# Altium project DC SUPPLY.PrjPcb
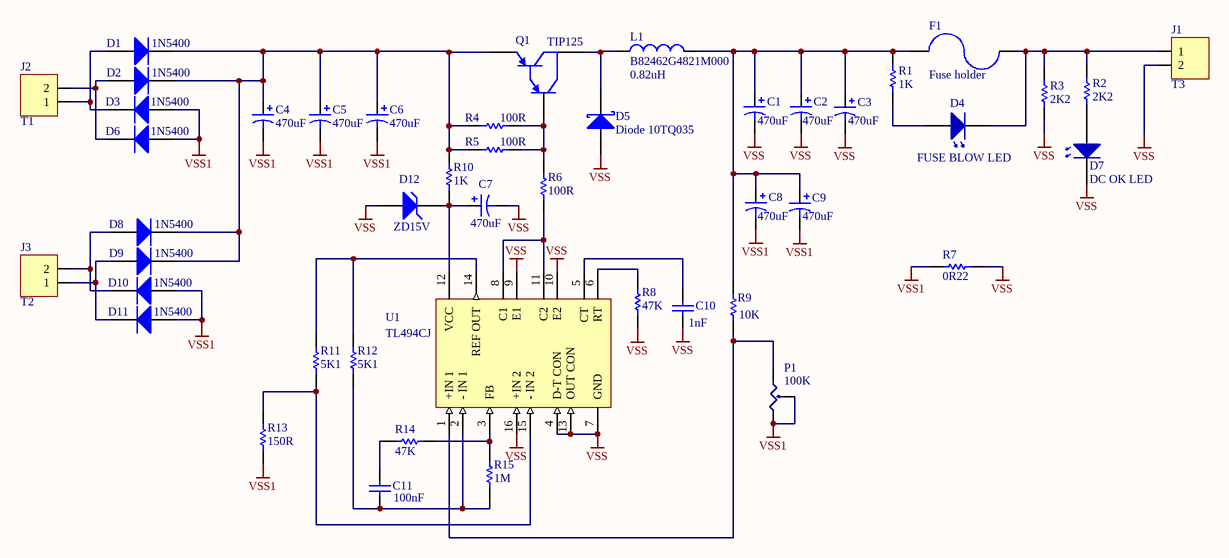
[diagram p0: DC SUPPLY.SchDoc]
1 sheet, 46 parts. Net scope: global (net labels, ports and power ports of the same name join across sheets).
Board file: DC SUPPLY.PcbDoc

## Sheet DC SUPPLY.SchDoc: DC Power Supply
size A4; Author: eldar6776@hotmail.com; DrawnBy: Eldar Dedić; Organization: PROVEN d.o.o.; Address1: Adema Buće 102; Address2: 71000 Sarajevo; Address3: Federacija BiH; Address4: Bosna i Hercegovina; DocumentNumber: DC-120614; Revision: 001; SheetNumber: 1; SheetTotal: 1; ProjectName: TRANSPORT MATERIJALA LINIJE 5

### Parts
C1  470uF  [CAPPR5-10X16]
C2  470uF  [CAPPR5-10X16]
C3  470uF  [CAPPR5-10X16]
C4  470uF  [CAPPR5-10X16]
C5  470uF  [CAPPR5-10X16]
C6  470uF  [CAPPR5-10X16]
C7  470uF  [CAPPR5-10X16]
C8  470uF  [CAPPR5-10X16]
C9  470uF  [CAPPR5-10X16]
C10  value 1nF  [0805]
C11  value 100nF  [0805]
D1  1N5400  [DO-201AD]
D2  1N5400  [DO-201AD]
D3  1N5400  [DO-201AD]
D4  FUSE BLOW LED  [LED 3 mm]
D5  Diode 10TQ035  [TO-220AC]
D6  1N5400  [DO-201AD]
D7  DC OK LED  [LED 3 mm]
D8  1N5400  [DO-201AD]
D9  1N5400  [DO-201AD]
D10  1N5400  [DO-201AD]
D11  1N5400  [DO-201AD]
D12  ZD15V  [299-02]
F1  Fuse holder  [FUSE HOLDER]
J1  T3  [TERMINAL_BLOCK_2]
J2  T1  [TERMINAL_BLOCK_2]
J3  T2  [TERMINAL_BLOCK_2]
L1  B82462G4821M000  value 0.82uH  [CAPPR5-10X16]
P1  100K  [POT]
Q1  TIP125  [221A-02]
R1  1K  [ERA-0805]
R2  2K2  [ERA-0805]
R3  2K2  [ERA-0805]
R4  100R  [RD3.2x1.7]
R5  100R  [RD3.2x1.7]
R6  100R  [RD3.2x1.7]
R7  0R22  [R9x2.8]
R8  47K  [ERA-0805]
R9  10K  [ERA-0805]
R10  1K  [RD6.35x2.3]
R11  5K1  [ERA-0805]
R12  5K1  [ERA-0805]
R13  150R  [ERA-0805]
R14  47K  [ERA-0805]
R15  1M  [ERA-0805]
U1  TL494CJ  [J016]

### Nets
VSS: C1.2 C2.2 C3.2 C7.2 C10.1 D5.3(A) D7.1 D12.1(A) J1.2 R3.1 R7.2 R8.1 U1.4(D-T_CON) U1.7(GND) U1.9(E1) U1.10(E2) U1.13(OUT_CON) U1.16(+IN_2)
VSS1: C4.2 C5.2 C6.2 C8.2 C9.2 D3.1(A) D6.1(A) D10.1(A) D11.1(A) P1.2 P1.3 R7.1 R13.1
NetC1_1: C1.1 C2.1 C3.1 C8.1 C9.1 F1.1 L1.2 R1.2 R9.2
NetC4_1: C4.1 C5.1 C6.1 D1.2(K) D2.2(K) D8.2(K) D9.2(K) Q1.3(E) R4.1 R5.1 R10.2
NetC7_1: C7.1 D12.2(K) R10.1 U1.12(VCC)
NetC10_2: C10.2 U1.5(CT)
NetC11_1: C11.1 R14.1
NetC11_2: C11.2 R12.1 R15.1 U1.2(-_IN_1)
NetD1_1: D1.1(A) D3.2(K) J2.1
NetD2_1: D2.1(A) D6.2(K) J2.2
NetD4_1: D4.1 F1.2 J1.1 R2.2 R3.2
NetD4_2: D4.2 R1.1
NetD5_1: D5.1(K) L1.1 Q1.2(C)
NetD7_2: D7.2 R2.1
NetD8_1: D8.1(A) D10.2(K) J3.2
NetD9_1: D9.1(A) D11.2(K) J3.1
NetP1_1: P1.1 R9.1 U1.1(+IN_1)
NetQ1_1: Q1.1(B) R4.2 R5.2 R6.2
NetR6_1: R6.1 U1.8(C1) U1.11(C2)
NetR8_2: R8.2 U1.6(RT)
NetR11_1: R11.1 R13.2 U1.15(-_IN_2)
NetR11_2: R11.2 R12.2 U1.14(REF_OUT)
NetR14_2: R14.2 R15.2 U1.3(FB)

### Notes on the sheet
- Title
- Size:
- Date:
- A4
- Number:
- Time:
- Revision:
- Sheet
- of
- File:

### Library data of the parts
C1-C9 = EKA00DD347F00: Aluminum Electrolytic Capacitor, Radial Style with Long Leads: 470uF, 35V; Note: Refer to Manufacturer's Data Sheets for other lead formations; DrillSize: Nominal, Rounded To The Nearest 0.1mm; Published: 19-Mar-2004; DatasheetDocument: 20-Feb-2001; PackageReference: CAPPR5-10X16; Publisher: Altium Limited; ComponentLink1Description: Manufacturer Link; ComponentLink1URL: http://www.vishay.com/; ComponentLink2Description: Datasheet; ComponentLink2URL: http://www.vishay.com/docs/25014/eka.pdf; Value: 470uF
C10 C11 = C0805: Ceramic Chip Capacitor - Standard; Note: Footprint corresponds to dimensions for bulk cassette packaging. This case size has tightened tolerances.; Published: 17-Jul-2002; LatestRevisionDate: 19-Mar-2004; LatestRevisionNote: Silkscreen size reduced.; DatasheetDocument: Mar-2001; PackageDocument: Mar-2001; PackageReference: 0805; Publisher: Altium Limited; Code_JEITA: 0805; Code_IPC: 2012[0805]; ComponentLink1Description: Manufacturer Link; ComponentLink1URL: http://www.kemet.com/; ComponentLink2Description: Datasheet; ComponentLink2URL: http://www.kemet.com/kemet/web/homepage/kechome.nsf/vapubfilesname/F3102TA.pdf/$file/F3102TA.pdf
D1-D3 D6 D8-D11 = 1N5400: 3.0 Ampere General Purpose Rectifier; Published: 8-Jun-2000; LatestRevisionDate: 17-Jul-2002; LatestRevisionNote: Re-released for DXP Platform.; DatasheetDocument: 1998; PackageDocument: Aug-1999; PackageReference: DO-201AD; Publisher: Altium Limited; ComponentLink1Description: Manufacturer Link; ComponentLink1URL: http://www.fairchildsemi.com/; ComponentLink2Description: Datasheet; ComponentLink2URL: http://www.fairchildsemi.com/ds/1N%2F1N5400.pdf
D4 D7 = 3mm LED
D5 = Diode 10TQ035: Schottky Rectifier; Note: Terminal 2 is the TAB and is electrically connected to the cathode; Published: 8-Jun-2000; LatestRevisionDate: 17-Jul-2002; LatestRevisionNote: Re-released for DXP Platform.; DatasheetVersion: PD-2.057B; PackageVersion: Feb-1998; PackageReference: TO-220AC; Publisher: Altium Limited; PackageDescription: TO, Thru-Hole, Vertical, Heatsink Mounted; 3 In-Line Leads (1 Absent); Pitch 2.54 mm; ComponentLink1Description: Manufacturer Link; ComponentLink1URL: http://www.irf.com/; ComponentLink2Description: Datasheet; ComponentLink2URL: http://www.irf.com/product-info/datasheets/data/10tq.pdf
D12 = 1N746A: 500 mW Hermetically Sealed Glass Silicon Zener Diode; Published: 29-Sep-2000; LatestRevisionDate: 17-Jul-2002; LatestRevisionNote: Re-released for DXP Platform.; PackageReference: 299-02; Publisher: Altium Limited; PackageDescription: Diode, Axial; Body 5.1 x 2.3 mm (LxDia. max), Lead Dia. 0.56 mm (max); Code_JEDEC: DO-204-AH; ComponentLink1Description: Manufacturer Link; ComponentLink1URL: http://www.onsemi.com/site/products/landing?taxonomyID=194
F1 = Fuse holder: glas fuse holder
J1-J3 = Terminal block 2: 2 pins terminal block
L1 = B82462G4821M000: SMT Power Inductor; Size 6.3×6.3×3.0mm, ±20% Tolerance, 0.82uH, 3.45A; PCB_Layout: Complies with manufacturer's recommendation.; Published: 26-Sep-2008; DatasheetVersion: Mar-2008; PackageVersion: Mar-2008; PackageReference: B82462G4; Publisher: Altium Limited; PackageDescription: SM Power Inductor; 2 Leads; Body 6.3 x 6.3 x 3.0 mm (LxWxH); ComponentLink1Description: Manufacturer Link; ComponentLink1URL: http://www.epcos.com/; ComponentLink2Description: Datasheet; ComponentLink2URL: http://www.epcos.com/inf/30/db/ind_2008/b82462g4.pdf
P1 = POT: PIHER poti vertical pcb mounting
Q1 = TIP125: Darlington Silicon Power PNP Transistor, 8 Amp, 60 Volts and 65 Watts; Note: Pin 2 is electrically connected to Pin 4 (TAB); Published: 19-Mar-2004; LatestRevisionDate: 06-Jun-2005; LatestRevisionNote: TAB pin 4 removed.; DatasheetVersion: 1984; PackageVersion: 1984; PackageReference: 221A-02; Publisher: Altium Limited; PackageDescription: TO, Thru-Hole, Vertical, Heatsink Mounted; 3 In-Line Leads; Pitch 2.54 mm; Code_JEDEC: TO-220-AB; ComponentLink1Description: Manufacturer Link; ComponentLink1URL: http://www.onsemi.com/site/products/landing?taxonomyID=194; ComponentLink2Description: Datasheet; ComponentLink2URL: http://www.onsemi.com/pub/Collateral/TIP120-D.PDF
R1-R3 R8 R9 R11-R15 = ERA6Y: Rectangular Thick Film Chip Resistor, 10 Ohm to 1M Ohm Range, 0.1% and 0.5% Tolerance, 0805 Size, 0.1 W; Note: If flow soldering, adjust pad width of PCB Footprint to 0.7 - 0.8 times the width of the resistor.; Published: 17-Dec-2003; LatestRevisionDate: 19-Mar-2004; LatestRevisionNote: Silkscreen size reduced.; PackageDocument: Mar-2003; PackageReference: ERA-0805; Publisher: Altium Limited; Code_IPC: 2012 [0805]; ComponentLink1Description: Manufacturer Link; ComponentLink1URL: http://www.panasonic.com/industrial/components/resistive_products.htm; ComponentLink2Description: Datasheet; ComponentLink2URL: http://www.panasonic.com/industrial/components/pdf/AOA0000CE8.pdf
R4-R6 = ERD6FC: Flame-Retardant Fuse Type Carbon Film Resistor, 4.7 Ohm to 1k Ohm Range, 2% and 5% Tolerance, 0.166 W; Published: 17-Dec-2003; PackageReference: RD3.2x1.7; Publisher: Altium Limited; ComponentLink1Description: Manufacturer Link; ComponentLink1URL: http://www.panasonic.com/industrial/components/resistive_products.htm; ComponentLink2Description: Datasheet; ComponentLink2URL: http://www.panasonic.com/industrial/components/pdf/AOB0000CE5.pdf
R7 = ERG1: Metal Oxide Film Resistor, 0.1 Ohm to 100k Ohm Range, 2% and 5% Tolerance, 1 W; Published: 17-Dec-2003; PackageReference: R9x2.8; Publisher: Altium Limited; ComponentLink1Description: Manufacturer Link; ComponentLink1URL: http://www.panasonic.com/industrial/components/resistive_products.htm; ComponentLink2Description: Datasheet; ComponentLink2URL: http://www.panasonic.com/industrial/components/pdf/AOA0000CE18.pdf
R10 = ERDS1T: Carbon Film Resistor, 1 Ohm to 3.3M Ohm Range, 5% Tolerance, 0.5 W; Published: 17-Dec-2003; PackageReference: RD6.35x2.3; Publisher: Altium Limited; ComponentLink1Description: Manufacturer Link; ComponentLink1URL: http://www.panasonic.com/industrial/components/resistive_products.htm; ComponentLink2Description: Datasheet; ComponentLink2URL: http://www.panasonic.com/industrial/components/pdf/AOA0000CE12.pdf
U1 = TL494CJ: Pulse-Width-Modulation Control Circuit; Published: 15-Apr-2002; LatestRevisionDate: 06-Jun-2005; LatestRevisionNote: Stylized 3D Model Added.; DatasheetVersion: Oct-1988; PackageVersion: Jun-1999; PackageReference: J016; Publisher: Altium Limited; PackageDescription: DIP; 16 Leads; Row Spacing 7.62 mm; Pitch 2.54 mm; ComponentLink1Description: Manufacturer Link; ComponentLink1URL: http://www.ti.com/